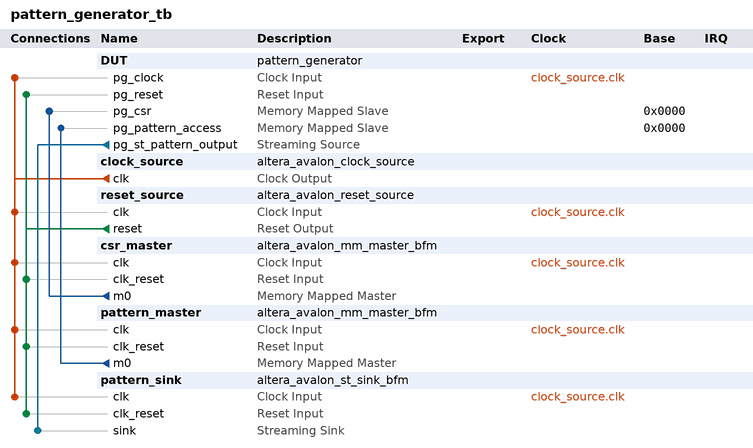
[diagram p0: system contents]
# Platform Designer (Qsys) system pattern_generator_tb
# Parameters at their usual value, and those the tool derives, are not listed.
package require -exact qsys 11.0
create_system pattern_generator_tb
set_project_property DEVICE_FAMILY CYCLONEIII

add_instance DUT pattern_generator 1.0

add_instance clock_source altera_avalon_clock_source 11.0
set_instance_parameter_value clock_source CLOCK_RATE 50

add_instance reset_source altera_avalon_reset_source 11.0
set_instance_parameter_value reset_source ASSERT_HIGH_RESET 1
set_instance_parameter_value reset_source INITIAL_RESET_CYCLES 50

add_instance csr_master altera_avalon_mm_master_bfm 11.0
set_instance_parameter_value csr_master AV_ADDRESS_W 2
set_instance_parameter_value csr_master AV_NUMSYMBOLS 4
set_instance_parameter_value csr_master AV_BURSTCOUNT_W 1
set_instance_parameter_value csr_master AV_READRESPONSE_W 1
set_instance_parameter_value csr_master AV_WRITERESPONSE_W 1
set_instance_parameter_value csr_master USE_READ 1
set_instance_parameter_value csr_master USE_BYTE_ENABLE 1
set_instance_parameter_value csr_master USE_BURSTCOUNT 0
set_instance_parameter_value csr_master USE_READ_DATA 1
set_instance_parameter_value csr_master USE_READ_DATA_VALID 0
set_instance_parameter_value csr_master USE_WAIT_REQUEST 0
set_instance_parameter_value csr_master AV_BURST_LINEWRAP 0
set_instance_parameter_value csr_master AV_BURST_BNDR_ONLY 0
set_instance_parameter_value csr_master AV_FIX_READ_LATENCY 1
set_instance_parameter_value csr_master AV_READ_WAIT_TIME 0
set_instance_parameter_value csr_master ADDRESS_UNITS WORDS

add_instance pattern_master altera_avalon_mm_master_bfm 11.0
set_instance_parameter_value pattern_master AV_ADDRESS_W 8
set_instance_parameter_value pattern_master AV_NUMSYMBOLS 4
set_instance_parameter_value pattern_master AV_BURSTCOUNT_W 1
set_instance_parameter_value pattern_master AV_READRESPONSE_W 1
set_instance_parameter_value pattern_master AV_WRITERESPONSE_W 1
set_instance_parameter_value pattern_master USE_READ 0
set_instance_parameter_value pattern_master USE_BYTE_ENABLE 1
set_instance_parameter_value pattern_master USE_BURSTCOUNT 0
set_instance_parameter_value pattern_master USE_READ_DATA 0
set_instance_parameter_value pattern_master USE_READ_DATA_VALID 0
set_instance_parameter_value pattern_master USE_WAIT_REQUEST 0
set_instance_parameter_value pattern_master AV_BURST_LINEWRAP 0
set_instance_parameter_value pattern_master AV_BURST_BNDR_ONLY 0
set_instance_parameter_value pattern_master AV_FIX_READ_LATENCY 0
set_instance_parameter_value pattern_master AV_READ_WAIT_TIME 1
set_instance_parameter_value pattern_master ADDRESS_UNITS WORDS

add_instance pattern_sink altera_avalon_st_sink_bfm 11.0
set_instance_parameter_value pattern_sink USE_PACKET 0
set_instance_parameter_value pattern_sink USE_CHANNEL 0
set_instance_parameter_value pattern_sink USE_ERROR 0
set_instance_parameter_value pattern_sink USE_READY 1
set_instance_parameter_value pattern_sink USE_VALID 1
set_instance_parameter_value pattern_sink USE_EMPTY 0
set_instance_parameter_value pattern_sink ST_SYMBOL_W 8
set_instance_parameter_value pattern_sink ST_NUMSYMBOLS 4
set_instance_parameter_value pattern_sink ST_CHANNEL_W 1
set_instance_parameter_value pattern_sink ST_ERROR_W 1
set_instance_parameter_value pattern_sink ST_READY_LATENCY 3
set_instance_parameter_value pattern_sink ST_MAX_CHANNELS 0

# connections
add_connection clock_source.clk csr_master.clk clock
add_connection clock_source.clk DUT.pg_clock clock
add_connection clock_source.clk pattern_master.clk clock
add_connection clock_source.clk pattern_sink.clk clock
add_connection clock_source.clk reset_source.clk clock
add_connection reset_source.reset csr_master.clk_reset reset
add_connection reset_source.reset DUT.pg_reset reset
add_connection reset_source.reset pattern_master.clk_reset reset
add_connection reset_source.reset pattern_sink.clk_reset reset
add_connection csr_master.m0 DUT.pg_csr avalon
set_connection_parameter_value csr_master.m0/DUT.pg_csr baseAddress 0x0000
add_connection pattern_master.m0 DUT.pg_pattern_access avalon
set_connection_parameter_value pattern_master.m0/DUT.pg_pattern_access baseAddress 0x0000
add_connection DUT.pg_st_pattern_output pattern_sink.sink avalon_streaming

save_system pattern_generator_tb.qsys
